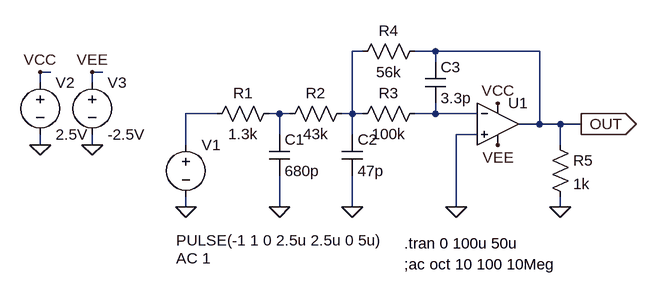
[diagram p0: schematic 3rd Multipule FeedBack.asc]
3rd Multipule FeedBack.asc, the LTspice schematic file:
Version 4
SHEET 1 880 680
WIRE 112 48 96 48
WIRE 224 48 192 48
WIRE 384 48 224 48
WIRE 224 64 224 48
WIRE -368 80 -384 80
WIRE -288 80 -304 80
WIRE -384 96 -384 80
WIRE -304 96 -304 80
WIRE -112 144 -160 144
WIRE -16 144 -32 144
WIRE 0 144 -16 144
WIRE 96 144 96 48
WIRE 96 144 80 144
WIRE 112 144 96 144
WIRE 224 144 224 128
WIRE 224 144 192 144
WIRE 288 144 224 144
WIRE 384 160 384 48
WIRE 384 160 352 160
WIRE 416 160 384 160
WIRE 448 160 416 160
WIRE -16 176 -16 144
WIRE 96 176 96 144
WIRE 288 176 256 176
WIRE -384 192 -384 176
WIRE -304 192 -304 176
WIRE -160 192 -160 144
WIRE 416 192 416 160
WIRE -160 288 -160 272
WIRE -16 288 -16 240
WIRE 96 288 96 240
WIRE 256 288 256 176
WIRE 416 288 416 272
FLAG -160 288 0
FLAG -16 288 0
FLAG 96 288 0
FLAG 256 288 0
FLAG 448 160 OUT
IOPIN 448 160 Out
FLAG 416 288 0
FLAG -384 192 0
FLAG -304 192 0
FLAG -384 80 VCC
FLAG -304 80 VEE
FLAG 320 128 VCC
FLAG 320 192 VEE
SYMBOL Opamps\\UniversalOpamp2 320 160 R0
SYMATTR InstName U1
SYMBOL res -16 128 R90
WINDOW 0 0 56 VBottom 2
WINDOW 3 32 56 VTop 2
SYMATTR InstName R1
SYMATTR Value 1.3k
SYMBOL res 96 128 R90
WINDOW 0 0 56 VBottom 2
WINDOW 3 32 56 VTop 2
SYMATTR InstName R2
SYMATTR Value 43k
SYMBOL res 208 128 R90
WINDOW 0 0 56 VBottom 2
WINDOW 3 32 56 VTop 2
SYMATTR InstName R3
SYMATTR Value 100k
SYMBOL res 208 32 R90
WINDOW 0 0 56 VBottom 2
WINDOW 3 32 56 VTop 2
SYMATTR InstName R4
SYMATTR Value 56k
SYMBOL cap -32 176 R0
SYMATTR InstName C1
SYMATTR Value 680p
SYMBOL cap 80 176 R0
SYMATTR InstName C2
SYMATTR Value 47p
SYMBOL cap 208 64 R0
SYMATTR InstName C3
SYMATTR Value 3.3p
SYMBOL voltage -160 176 R0
WINDOW 3 -15 163 Left 2
WINDOW 123 -15 191 Left 2
WINDOW 39 0 0 Left 2
SYMATTR Value PULSE(-1 1 0 2.5u 2.5u 0 5u)
SYMATTR Value2 AC 1
SYMATTR InstName V1
SYMBOL res 400 176 R0
SYMATTR InstName R5
SYMATTR Value 1k
SYMBOL voltage -384 80 R0
WINDOW 123 0 0 Left 2
WINDOW 39 0 0 Left 2
SYMATTR InstName V2
SYMATTR Value 2.5V
SYMBOL voltage -304 80 R0
WINDOW 123 0 0 Left 2
WINDOW 39 0 0 Left 2
SYMATTR InstName V3
SYMATTR Value -2.5V
TEXT 176 344 Left 2 !.tran 0 100u 50u
TEXT 176 376 Left 2 !;ac oct 10 100 10Meg

The netlist it stands for:
* 3rd Multipule FeedBack.asc
XU1 0 N004 VCC VEE OUT level.2 Avol=1Meg GBW=10Meg Slew=10Meg ilimit=25m rail=0 Vos=0 phimargin=45 en=0 enk=0 in=0 ink=0 Rin=500Meg  ; pins IN+ IN- V+ V- OUT
R1 N003 N002 1.3k
R2 N001 N003 43k
R3 N004 N001 100k
R4 OUT N001 56k
C1 N003 0 680p
C2 N001 0 47p
C3 OUT N004 3.3p
V1 N002 0 PULSE(-1 1 0 2.5u 2.5u 0 5u) AC 1
R5 OUT 0 1k
V2 VCC 0 2.5V
V3 VEE 0 -2.5V
.tran 0 100u 50u
;ac oct 10 100 10Meg
.lib UniversalOpamps2.sub
.backanno
.end